# Altium schematic sheet relay_pi_interface.SchDoc
size A4; SheetNumber: 3; SheetTotal: 4; SPICEModelCacheSLNRDRPT: <root> / <DocumentId>SLNRDRPT</DocumentId> / </root>
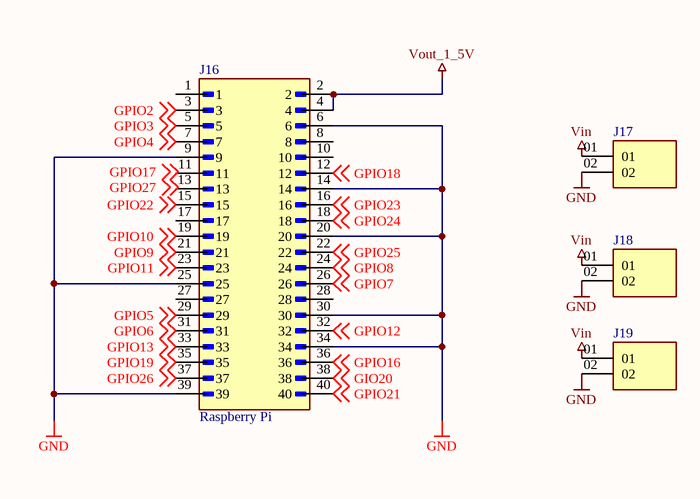
[diagram p0: relay_pi_interface.SchDoc]

## Parts
J16  Raspberry Pi  [MODULE_RASPBERRY_PI_3_MODEL_B+]
J17  BBS-102-T-A  [SAMTEC_BBS-102-T-A]  (value not drawn)
J18  BBS-102-T-A  [SAMTEC_BBS-102-T-A]  (value not drawn)
J19  BBS-102-T-A  [SAMTEC_BBS-102-T-A]  (value not drawn)

## Nets
GND: J16.6 J16.9 J16.14 J16.20 J16.25 J16.30 J16.34 J16.39 J17.02 J18.02 J19.02
Vin: J17.01 J18.01 J19.01
Vout_1_5V: J16.2 J16.4
GIO20: J16.38 ; off-sheet GIO20
GPIO2: J16.3 ; off-sheet GPIO2
GPIO3: J16.5 ; off-sheet GPIO3
GPIO4: J16.7 ; off-sheet GPIO4
GPIO5: J16.29 ; off-sheet GPIO5
GPIO6: J16.31 ; off-sheet GPIO6
GPIO7: J16.26 ; off-sheet GPIO7
GPIO8: J16.24 ; off-sheet GPIO8
GPIO9: J16.21 ; off-sheet GPIO9
GPIO10: J16.19 ; off-sheet GPIO10
GPIO11: J16.23 ; off-sheet GPIO11
GPIO12: J16.32 ; off-sheet GPIO12
GPIO13: J16.33 ; off-sheet GPIO13
GPIO16: J16.36 ; off-sheet GPIO16
GPIO18: J16.12 ; off-sheet GPIO18
GPIO19: J16.35 ; off-sheet GPIO19
GPIO21: J16.40 ; off-sheet GPIO21
GPIO22: J16.15 ; off-sheet GPIO22
GPIO23: J16.16 ; off-sheet GPIO23
GPIO24: J16.18 ; off-sheet GPIO24
GPIO25: J16.22 ; off-sheet GPIO25
GPIO26: J16.37 ; off-sheet GPIO26

Not connected (* = marked no-connect by the designer): J16 1 8 10 11 13 17 27 28

## Notes on the sheet
- Labels drawn without touching a wire or pin: GPIO17, GPIO27

## Library data of the parts
J16 = SBH11-PBPC-D20-RA-BK: Connector Header Through Hole, Right Angle 40 position 0.100 (2.54mm); MF: Sullins Connector; SnapEDA_Link: https://www.snapeda.com/parts/SBH11-PBPC-D20-RA-BK/Sullins+Connector+Solutions/view-part/?ref=snap; Package: None; Value: *; MP: SBH11-PBPC-D20-RA-BK; Check_prices: https://www.snapeda.com/parts/SBH11-PBPC-D20-RA-BK/Sullins+Connector+Solutions/view-part/?ref=eda
J17-J19 = BBS-102-T-A: HEADER, 2.54MM, PCB, 1X2 POSITION; Product Range:BBS Series; No. of Contacts:2Contacts; Gender:Header; Pitch Spacing:2.54mm; Contact Termination Type:Through Hole; No. of Rows:1Rows; Contact Plating:Tin Plated Contacts RoHS Compliant: Yes; MF: Samtec; MP: BBS102TA; SnapEDA_Link: https://www.snapeda.com/parts/BBS102TA/Samtec/view-part/?ref=snap; Package: None; Value: *; Check_prices: https://www.snapeda.com/parts/BBS102TA/Samtec/view-part/?ref=eda